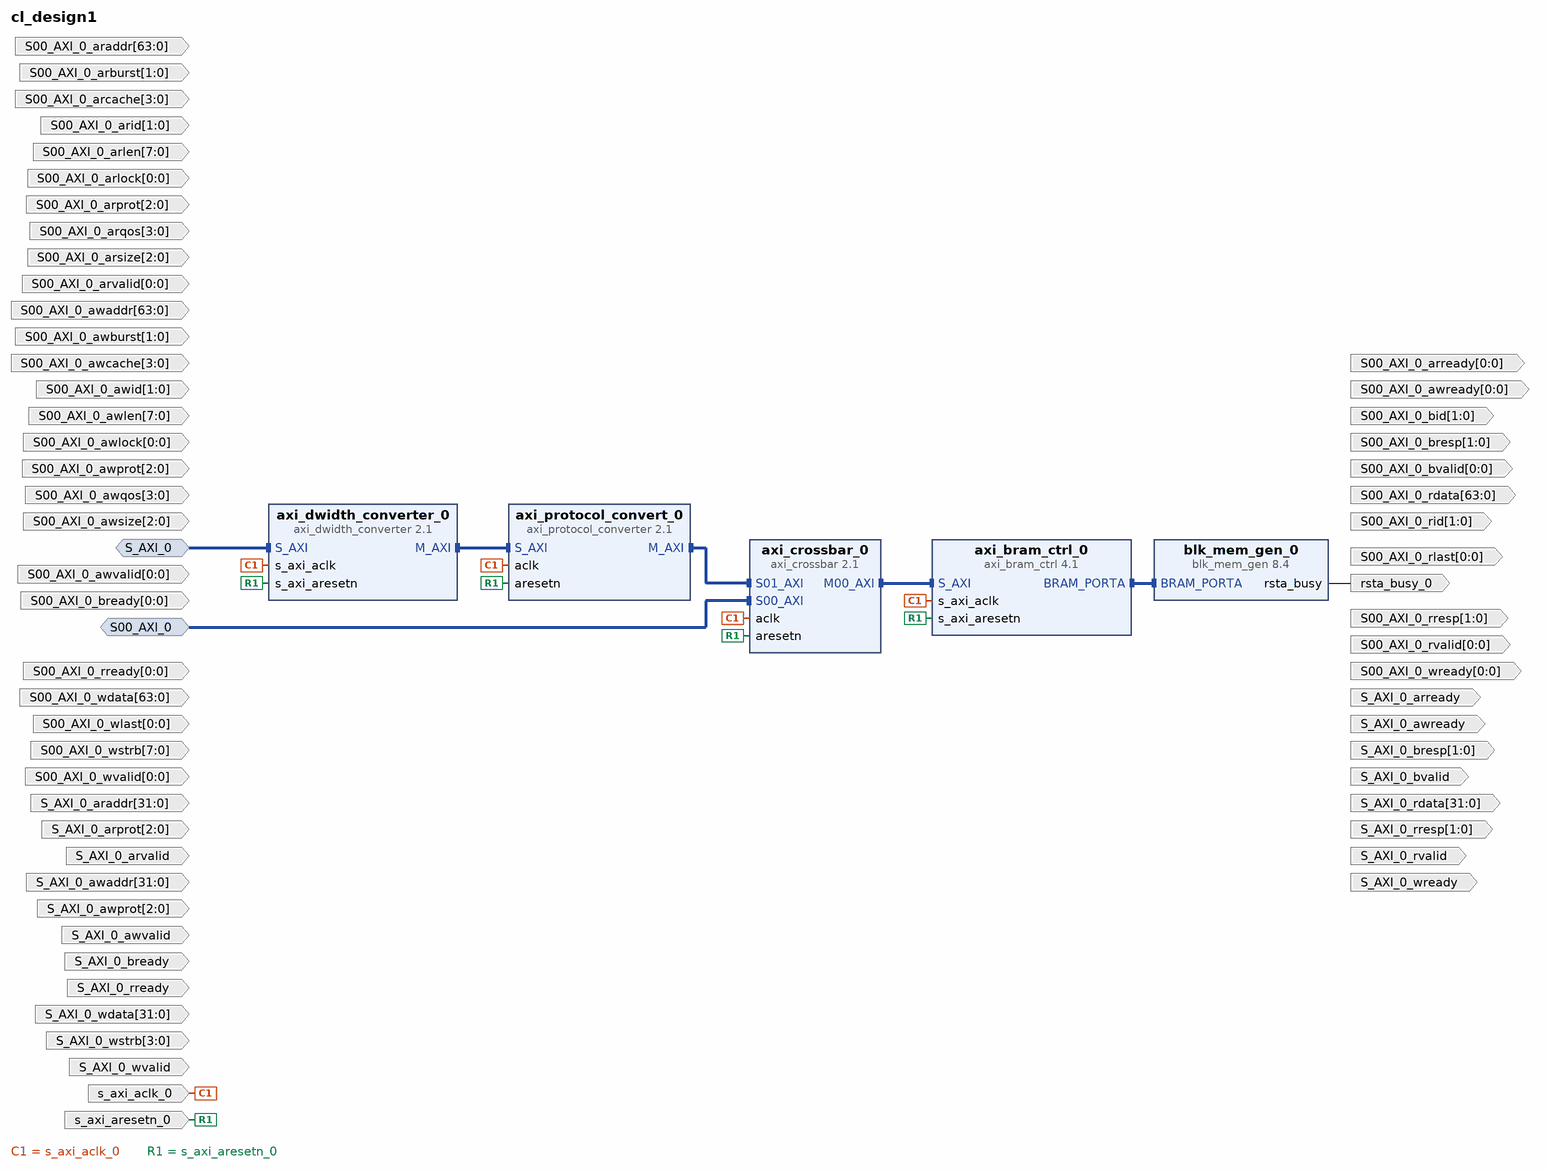
[diagram p0: block diagram of the top level]
# Vivado block design cl_design1, xcvu9p-flga2104-1-e, Vivado 2021.1
create_bd_design cl_design1

create_bd_intf_port -mode Slave -vlnv xilinx.com:interface:aximm_rtl:1.0 S00_AXI_0
set_property -dict [list \
  CONFIG.ADDR_WIDTH 64 \
  CONFIG.ARUSER_WIDTH 0 \
  CONFIG.AWUSER_WIDTH 0 \
  CONFIG.BUSER_WIDTH 0 \
  CONFIG.DATA_WIDTH 64 \
  CONFIG.FREQ_HZ 10000000 \
  CONFIG.HAS_BRESP 1 \
  CONFIG.HAS_BURST 1 \
  CONFIG.HAS_CACHE 1 \
  CONFIG.HAS_LOCK 1 \
  CONFIG.HAS_PROT 1 \
  CONFIG.HAS_QOS 1 \
  CONFIG.HAS_REGION 0 \
  CONFIG.HAS_RRESP 1 \
  CONFIG.HAS_WSTRB 1 \
  CONFIG.ID_WIDTH 1 \
  CONFIG.MAX_BURST_LENGTH 256 \
  CONFIG.NUM_READ_OUTSTANDING 2 \
  CONFIG.NUM_READ_THREADS 1 \
  CONFIG.NUM_WRITE_OUTSTANDING 2 \
  CONFIG.NUM_WRITE_THREADS 1 \
  CONFIG.PROTOCOL AXI4 \
  CONFIG.READ_WRITE_MODE READ_WRITE \
  CONFIG.RUSER_BITS_PER_BYTE 0 \
  CONFIG.RUSER_WIDTH 0 \
  CONFIG.SUPPORTS_NARROW_BURST 1 \
  CONFIG.WUSER_BITS_PER_BYTE 0 \
  CONFIG.WUSER_WIDTH 0 \
] [get_bd_intf_ports S00_AXI_0]
create_bd_intf_port -mode Slave -vlnv xilinx.com:interface:aximm_rtl:1.0 S_AXI_0
set_property -dict [list \
  CONFIG.ADDR_WIDTH 32 \
  CONFIG.ARUSER_WIDTH 0 \
  CONFIG.AWUSER_WIDTH 0 \
  CONFIG.BUSER_WIDTH 0 \
  CONFIG.DATA_WIDTH 32 \
  CONFIG.FREQ_HZ 10000000 \
  CONFIG.HAS_BRESP 1 \
  CONFIG.HAS_BURST 0 \
  CONFIG.HAS_CACHE 0 \
  CONFIG.HAS_LOCK 0 \
  CONFIG.HAS_PROT 1 \
  CONFIG.HAS_QOS 0 \
  CONFIG.HAS_REGION 0 \
  CONFIG.HAS_RRESP 1 \
  CONFIG.HAS_WSTRB 1 \
  CONFIG.ID_WIDTH 0 \
  CONFIG.MAX_BURST_LENGTH 1 \
  CONFIG.NUM_READ_OUTSTANDING 1 \
  CONFIG.NUM_READ_THREADS 1 \
  CONFIG.NUM_WRITE_OUTSTANDING 1 \
  CONFIG.NUM_WRITE_THREADS 1 \
  CONFIG.PROTOCOL AXI4LITE \
  CONFIG.READ_WRITE_MODE READ_WRITE \
  CONFIG.RUSER_BITS_PER_BYTE 0 \
  CONFIG.RUSER_WIDTH 0 \
  CONFIG.SUPPORTS_NARROW_BURST 0 \
  CONFIG.WUSER_BITS_PER_BYTE 0 \
  CONFIG.WUSER_WIDTH 0 \
] [get_bd_intf_ports S_AXI_0]
create_bd_port -dir O rsta_busy_0
create_bd_port -dir I -type clk s_axi_aclk_0
set_property -dict {CONFIG.FREQ_HZ 10000000} [get_bd_ports s_axi_aclk_0]
create_bd_port -dir I -type rst s_axi_aresetn_0
create_bd_port -dir I -from 1 -to 0 S00_AXI_0_awid
create_bd_port -dir I -from 63 -to 0 S00_AXI_0_awaddr
create_bd_port -dir I -from 7 -to 0 S00_AXI_0_awlen
create_bd_port -dir I -from 2 -to 0 S00_AXI_0_awsize
create_bd_port -dir I -from 1 -to 0 S00_AXI_0_awburst
create_bd_port -dir I -from 0 -to 0 S00_AXI_0_awlock
create_bd_port -dir I -from 3 -to 0 S00_AXI_0_awcache
create_bd_port -dir I -from 2 -to 0 S00_AXI_0_awprot
create_bd_port -dir I -from 3 -to 0 S00_AXI_0_awqos
create_bd_port -dir I -from 0 -to 0 S00_AXI_0_awvalid
create_bd_port -dir O -from 0 -to 0 S00_AXI_0_awready
create_bd_port -dir I -from 63 -to 0 S00_AXI_0_wdata
create_bd_port -dir I -from 7 -to 0 S00_AXI_0_wstrb
create_bd_port -dir I -from 0 -to 0 S00_AXI_0_wlast
create_bd_port -dir I -from 0 -to 0 S00_AXI_0_wvalid
create_bd_port -dir O -from 0 -to 0 S00_AXI_0_wready
create_bd_port -dir O -from 1 -to 0 S00_AXI_0_bid
create_bd_port -dir O -from 1 -to 0 S00_AXI_0_bresp
create_bd_port -dir O -from 0 -to 0 S00_AXI_0_bvalid
create_bd_port -dir I -from 0 -to 0 S00_AXI_0_bready
create_bd_port -dir I -from 1 -to 0 S00_AXI_0_arid
create_bd_port -dir I -from 63 -to 0 S00_AXI_0_araddr
create_bd_port -dir I -from 7 -to 0 S00_AXI_0_arlen
create_bd_port -dir I -from 2 -to 0 S00_AXI_0_arsize
create_bd_port -dir I -from 1 -to 0 S00_AXI_0_arburst
create_bd_port -dir I -from 0 -to 0 S00_AXI_0_arlock
create_bd_port -dir I -from 3 -to 0 S00_AXI_0_arcache
create_bd_port -dir I -from 2 -to 0 S00_AXI_0_arprot
create_bd_port -dir I -from 3 -to 0 S00_AXI_0_arqos
create_bd_port -dir I -from 0 -to 0 S00_AXI_0_arvalid
create_bd_port -dir O -from 0 -to 0 S00_AXI_0_arready
create_bd_port -dir O -from 1 -to 0 S00_AXI_0_rid
create_bd_port -dir O -from 63 -to 0 S00_AXI_0_rdata
create_bd_port -dir O -from 1 -to 0 S00_AXI_0_rresp
create_bd_port -dir O -from 0 -to 0 S00_AXI_0_rlast
create_bd_port -dir O -from 0 -to 0 S00_AXI_0_rvalid
create_bd_port -dir I -from 0 -to 0 S00_AXI_0_rready
create_bd_port -dir I -from 31 -to 0 S_AXI_0_awaddr
create_bd_port -dir I -from 2 -to 0 S_AXI_0_awprot
create_bd_port -dir I S_AXI_0_awvalid
create_bd_port -dir O S_AXI_0_awready
create_bd_port -dir I -from 31 -to 0 S_AXI_0_wdata
create_bd_port -dir I -from 3 -to 0 S_AXI_0_wstrb
create_bd_port -dir I S_AXI_0_wvalid
create_bd_port -dir O S_AXI_0_wready
create_bd_port -dir O -from 1 -to 0 S_AXI_0_bresp
create_bd_port -dir O S_AXI_0_bvalid
create_bd_port -dir I S_AXI_0_bready
create_bd_port -dir I -from 31 -to 0 S_AXI_0_araddr
create_bd_port -dir I -from 2 -to 0 S_AXI_0_arprot
create_bd_port -dir I S_AXI_0_arvalid
create_bd_port -dir O S_AXI_0_arready
create_bd_port -dir O -from 31 -to 0 S_AXI_0_rdata
create_bd_port -dir O -from 1 -to 0 S_AXI_0_rresp
create_bd_port -dir O S_AXI_0_rvalid
create_bd_port -dir I S_AXI_0_rready

create_bd_cell -type ip -vlnv xilinx.com:ip:axi_crossbar:2.1 axi_crossbar_0
set_property -dict [list \
  CONFIG.ADDR_WIDTH 64 \
  CONFIG.DATA_WIDTH 64 \
  CONFIG.ID_WIDTH 2 \
  CONFIG.M00_A00_ADDR_WIDTH 64 \
  CONFIG.M00_A00_BASE_ADDR 0x0000000000000000 \
  CONFIG.NUM_MI 1 \
  CONFIG.NUM_SI 2 \
  CONFIG.S01_BASE_ID 0x00000002 \
  CONFIG.S02_BASE_ID 0x00000004 \
  CONFIG.S03_BASE_ID 0x00000006 \
  CONFIG.S04_BASE_ID 0x00000008 \
  CONFIG.S05_BASE_ID 0x0000000a \
  CONFIG.S06_BASE_ID 0x0000000c \
  CONFIG.S07_BASE_ID 0x0000000e \
  CONFIG.S08_BASE_ID 0x00000010 \
  CONFIG.S09_BASE_ID 0x00000012 \
  CONFIG.S10_BASE_ID 0x00000014 \
  CONFIG.S11_BASE_ID 0x00000016 \
  CONFIG.S12_BASE_ID 0x00000018 \
  CONFIG.S13_BASE_ID 0x0000001a \
  CONFIG.S14_BASE_ID 0x0000001c \
  CONFIG.S15_BASE_ID 0x0000001e \
] [get_bd_cells axi_crossbar_0]
create_bd_cell -type ip -vlnv xilinx.com:ip:axi_protocol_converter:2.1 axi_protocol_convert_0
set_property -dict [list \
  CONFIG.ADDR_WIDTH 64 \
  CONFIG.DATA_WIDTH 64 \
  CONFIG.MI_PROTOCOL AXI4 \
  CONFIG.SI_PROTOCOL AXI4LITE \
  CONFIG.TRANSLATION_MODE 2 \
] [get_bd_cells axi_protocol_convert_0]
create_bd_cell -type ip -vlnv xilinx.com:ip:blk_mem_gen:8.4 blk_mem_gen_0
set_property -dict [list \
  CONFIG.EN_SAFETY_CKT true \
  CONFIG.Enable_32bit_Address true \
  CONFIG.Read_Width_A 64 \
  CONFIG.Register_PortA_Output_of_Memory_Primitives false \
  CONFIG.Use_RSTA_Pin true \
  CONFIG.Write_Width_A 64 \
  CONFIG.use_bram_block BRAM_Controller \
] [get_bd_cells blk_mem_gen_0]
create_bd_cell -type ip -vlnv xilinx.com:ip:axi_bram_ctrl:4.1 axi_bram_ctrl_0
set_property -dict {CONFIG.DATA_WIDTH 64 CONFIG.SINGLE_PORT_BRAM 1} [get_bd_cells axi_bram_ctrl_0]
create_bd_cell -type ip -vlnv xilinx.com:ip:axi_dwidth_converter:2.1 axi_dwidth_converter_0
set_property -dict {CONFIG.PROTOCOL AXI4LITE} [get_bd_cells axi_dwidth_converter_0]

# ---- connections ----

connect_bd_intf_net -intf_net S00_AXI_0_1 [get_bd_intf_ports S00_AXI_0] [get_bd_intf_pins axi_crossbar_0/S00_AXI]
connect_bd_intf_net -intf_net S_AXI_0_1 [get_bd_intf_ports S_AXI_0] [get_bd_intf_pins axi_dwidth_converter_0/S_AXI]
connect_bd_intf_net [get_bd_intf_pins axi_bram_ctrl_0/BRAM_PORTA] [get_bd_intf_pins blk_mem_gen_0/BRAM_PORTA]
connect_bd_intf_net [get_bd_intf_pins axi_crossbar_0/M00_AXI] [get_bd_intf_pins axi_bram_ctrl_0/S_AXI]
connect_bd_intf_net [get_bd_intf_pins axi_dwidth_converter_0/M_AXI] [get_bd_intf_pins axi_protocol_convert_0/S_AXI]
connect_bd_intf_net [get_bd_intf_pins axi_protocol_convert_0/M_AXI] [get_bd_intf_pins axi_crossbar_0/S01_AXI]
connect_bd_net [get_bd_pins blk_mem_gen_0/rsta_busy] [get_bd_ports rsta_busy_0]
connect_bd_net -net s_axi_aclk_0_1 [get_bd_ports s_axi_aclk_0] \
  [get_bd_pins axi_dwidth_converter_0/s_axi_aclk] [get_bd_pins axi_protocol_convert_0/aclk] \
  [get_bd_pins axi_bram_ctrl_0/s_axi_aclk] [get_bd_pins axi_crossbar_0/aclk]
connect_bd_net -net s_axi_aresetn_0_1 [get_bd_ports s_axi_aresetn_0] \
  [get_bd_pins axi_dwidth_converter_0/s_axi_aresetn] [get_bd_pins axi_protocol_convert_0/aresetn] \
  [get_bd_pins axi_crossbar_0/aresetn] [get_bd_pins axi_bram_ctrl_0/s_axi_aresetn]

validate_bd_design
save_bd_design
